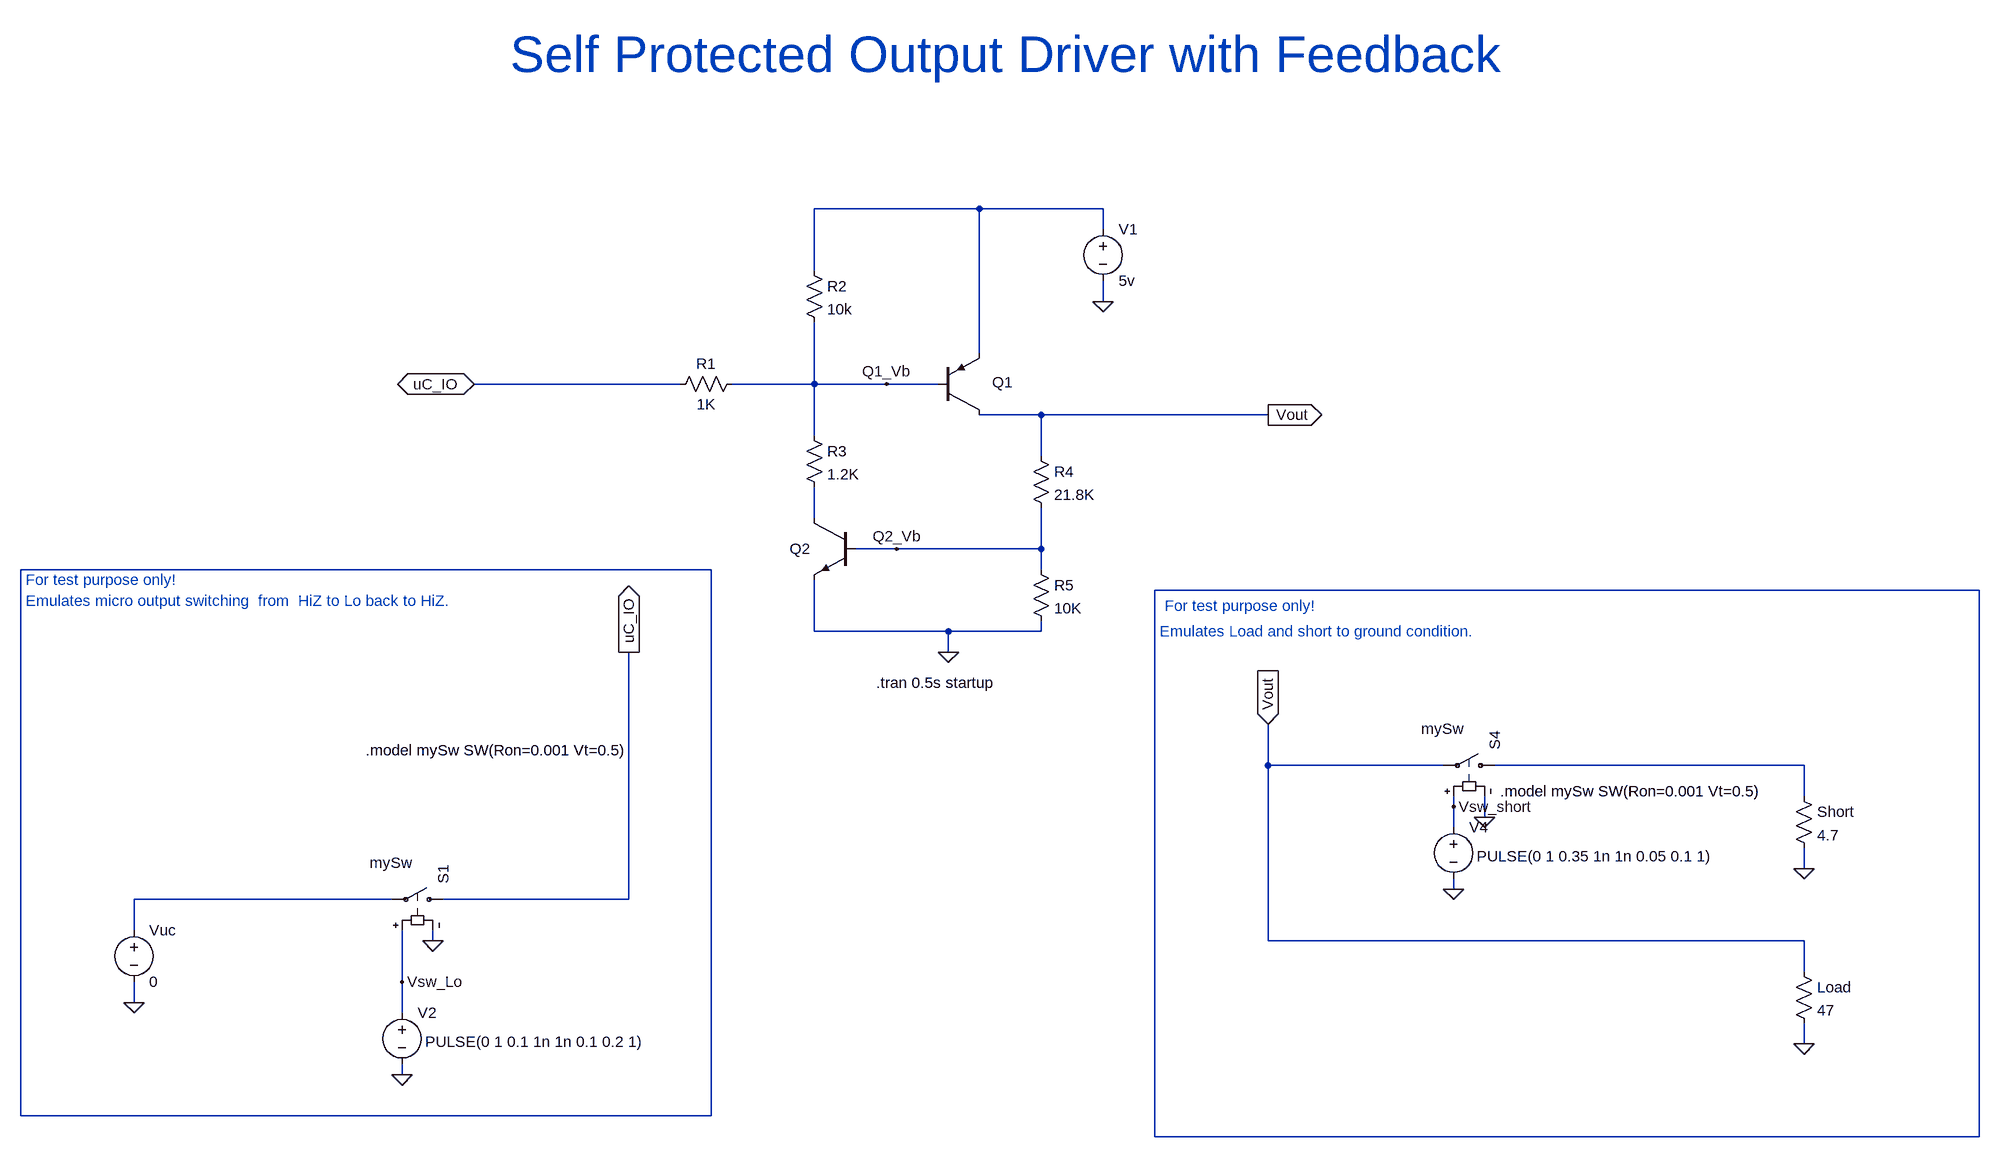
[diagram p0: schematic BiDir_Disc_IO_5V.asc]
BiDir_Disc_IO_5V.asc, the LTspice schematic file:
Version 4
SHEET 1 1972 852
WIRE 416 -592 160 -592
WIRE 608 -592 416 -592
WIRE 608 -560 608 -592
WIRE 160 -496 160 -592
WIRE 608 -448 608 -480
WIRE 416 -368 416 -592
WIRE -48 -320 -368 -320
WIRE 160 -320 160 -416
WIRE 160 -320 32 -320
WIRE 272 -320 160 -320
WIRE 352 -320 272 -320
WIRE 512 -272 416 -272
WIRE 864 -272 512 -272
WIRE 160 -240 160 -320
WIRE 512 -208 512 -272
WIRE 160 -112 160 -160
WIRE 288 -64 224 -64
WIRE 512 -64 512 -128
WIRE 512 -64 288 -64
WIRE 0 -32 -1072 -32
WIRE 512 -32 512 -64
WIRE 1968 0 688 0
WIRE 160 64 160 -16
WIRE 368 64 160 64
WIRE 512 64 512 48
WIRE 512 64 368 64
WIRE 368 96 368 64
WIRE 864 272 864 208
WIRE 1136 272 864 272
WIRE 1696 272 1216 272
WIRE 1696 320 1696 272
WIRE 1152 336 1152 320
WIRE 1200 352 1200 320
WIRE 1152 368 1152 336
WIRE 1696 432 1696 400
WIRE 1152 464 1152 448
WIRE -496 480 -896 480
WIRE -128 480 -128 96
WIRE -128 480 -416 480
WIRE -896 528 -896 480
WIRE -432 544 -432 528
WIRE 864 544 864 272
WIRE 1696 544 864 544
WIRE 1696 592 1696 544
WIRE -480 608 -480 528
WIRE -896 640 -896 608
WIRE -480 656 -480 608
WIRE 1696 704 1696 672
WIRE -480 752 -480 736
WIRE -1072 816 -1072 -32
WIRE 0 816 0 -32
WIRE 0 816 -1072 816
WIRE 688 848 688 0
WIRE 1968 848 1968 0
WIRE 1968 848 688 848
FLAG 368 96 0
FLAG -368 -320 uC_IO
IOPIN -368 -320 BiDir
FLAG 608 -448 0
FLAG -480 752 0
FLAG -896 640 0
FLAG -432 544 0
FLAG 864 -272 Vout
IOPIN 864 -272 Out
FLAG -480 608 Vsw_Lo
FLAG 288 -64 Q2_Vb
FLAG 272 -320 Q1_Vb
FLAG -128 96 uC_IO
IOPIN -128 96 Out
FLAG 1152 464 0
FLAG 1152 336 Vsw_short
FLAG 1200 352 0
FLAG 1696 704 0
FLAG 1696 432 0
FLAG 864 208 Vout
IOPIN 864 208 In
SYMBOL npn 224 -112 M0
WINDOW 0 70 48 Left 2
WINDOW 3 56 68 Invisible 2
SYMATTR InstName Q2
SYMBOL pnp 352 -272 M180
WINDOW 0 84 51 Left 2
WINDOW 3 84 68 Invisible 2
SYMATTR InstName Q1
SYMBOL res 496 -224 R0
SYMATTR InstName R4
SYMATTR Value 21.8K
SYMBOL res 496 -48 R0
SYMATTR InstName R5
SYMATTR Value 10K
SYMBOL res 144 -512 R0
SYMATTR InstName R2
SYMATTR Value 10k
SYMBOL res 144 -256 R0
SYMATTR InstName R3
SYMATTR Value 1.2K
SYMBOL res 48 -336 R90
WINDOW 0 0 56 VBottom 2
WINDOW 3 32 56 VTop 2
SYMATTR InstName R1
SYMATTR Value 1K
SYMBOL voltage 608 -576 R0
WINDOW 123 0 0 Left 2
WINDOW 39 0 0 Left 2
SYMATTR InstName V1
SYMATTR Value 5v
SYMBOL sw -400 480 M270
WINDOW 3 57 130 VLeft 2
SYMATTR Value mySw
SYMATTR InstName S1
SYMBOL voltage -480 640 R0
WINDOW 3 36 61 Left 2
WINDOW 123 0 0 Left 2
WINDOW 39 0 0 Left 2
SYMATTR Value PULSE(0 1 0.1 1n 1n 0.1 0.2 1)
SYMATTR InstName V2
SYMBOL voltage -896 512 R0
WINDOW 123 0 0 Left 2
WINDOW 39 0 0 Left 2
SYMATTR InstName Vuc
SYMATTR Value 0
SYMBOL voltage 1152 352 R0
WINDOW 3 36 61 Left 2
WINDOW 123 0 0 Left 2
WINDOW 39 0 0 Left 2
SYMATTR Value PULSE(0 1 0.35 1n 1n 0.05 0.1 1)
SYMATTR InstName V4
SYMBOL sw 1232 272 M270
WINDOW 3 57 130 VLeft 2
SYMATTR Value mySw
SYMATTR InstName S4
SYMBOL res 1680 304 R0
SYMATTR InstName Short
SYMATTR Value 4.7
SYMBOL res 1680 576 R0
SYMATTR InstName Load
SYMATTR Value 47
TEXT 256 144 Left 2 !.tran 0.5s startup
TEXT -536 248 Left 2 !.model mySw SW(Ron=0.001 Vt=0.5)
TEXT -1064 -16 Left 2 ;For test purpose only!
TEXT -1064 16 Left 2 ;Emulates micro output switching  from  HiZ to Lo back to HiZ.
TEXT 1224 312 Left 2 !.model mySw SW(Ron=0.001 Vt=0.5)
TEXT 704 24 Left 2 ;For test purpose only!
TEXT 696 64 Left 2 ;Emulates Load and short to ground condition.
TEXT -312 -832 Left 6 ;Self Protected Output Driver with Feedback

The netlist it stands for:
* BiDir_Disc_IO_5V.asc
Q2 N002 Q2_Vb 0 0 NPN
Q1 Vout Q1_Vb N001 0 PNP
R4 Vout Q2_Vb 21.8K
R5 Q2_Vb 0 10K
R2 N001 Q1_Vb 10k
R3 Q1_Vb N002 1.2K
R1 Q1_Vb uC_IO 1K
V1 N001 0 5v
S1 uC_IO N006 Vsw_Lo 0 mySw
V2 Vsw_Lo 0 PULSE(0 1 0.1 1n 1n 0.1 0.2 1)
Vuc N006 0 0
V4 Vsw_short 0 PULSE(0 1 0.35 1n 1n 0.05 0.1 1)
S4 N005 Vout Vsw_short 0 mySw
R§Short N005 0 4.7
R§Load Vout 0 47
.model NPN NPN
.model PNP PNP
.lib standard.bjt
.tran 0.5s startup
.model mySw SW(Ron=0.001 Vt=0.5)
* For test purpose only!
* Emulates micro output switching  from  HiZ to Lo back to HiZ.
.model mySw SW(Ron=0.001 Vt=0.5)
* For test purpose only!
* Emulates Load and short to ground condition.
* Self Protected Output Driver with Feedback
.backanno
.end